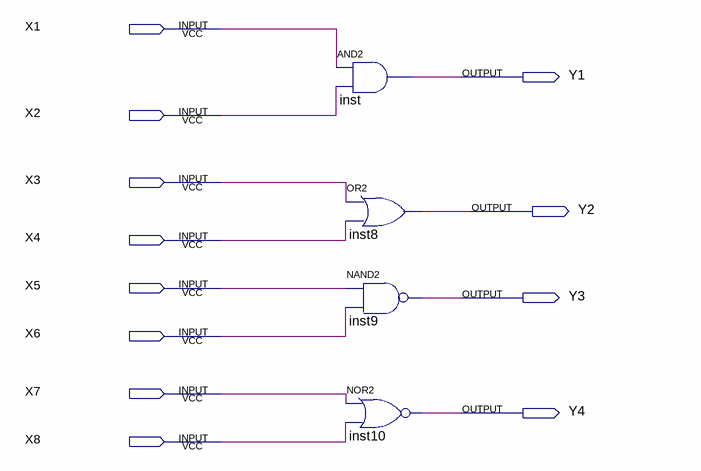
[diagram p0: schematic sheet]
// Quartus schematic lab1.bdf as structural Verilog: 4 symbols, 12 pins
module lab1 (
  input  X1,
  input  X2,
  input  X3,
  input  X4,
  input  X5,
  input  X6,
  input  X7,
  input  X8,
  output Y1,
  output Y2,
  output Y3,
  output Y4
);

  and inst (Y1, X1, X2);
  or inst8 (Y2, X3, X4);
  nand inst9 (Y3, X5, X6);
  nor inst10 (Y4, X7, X8);
endmodule
